# EAGLE design Controller Yanuar (EAGLE 7.7.0)
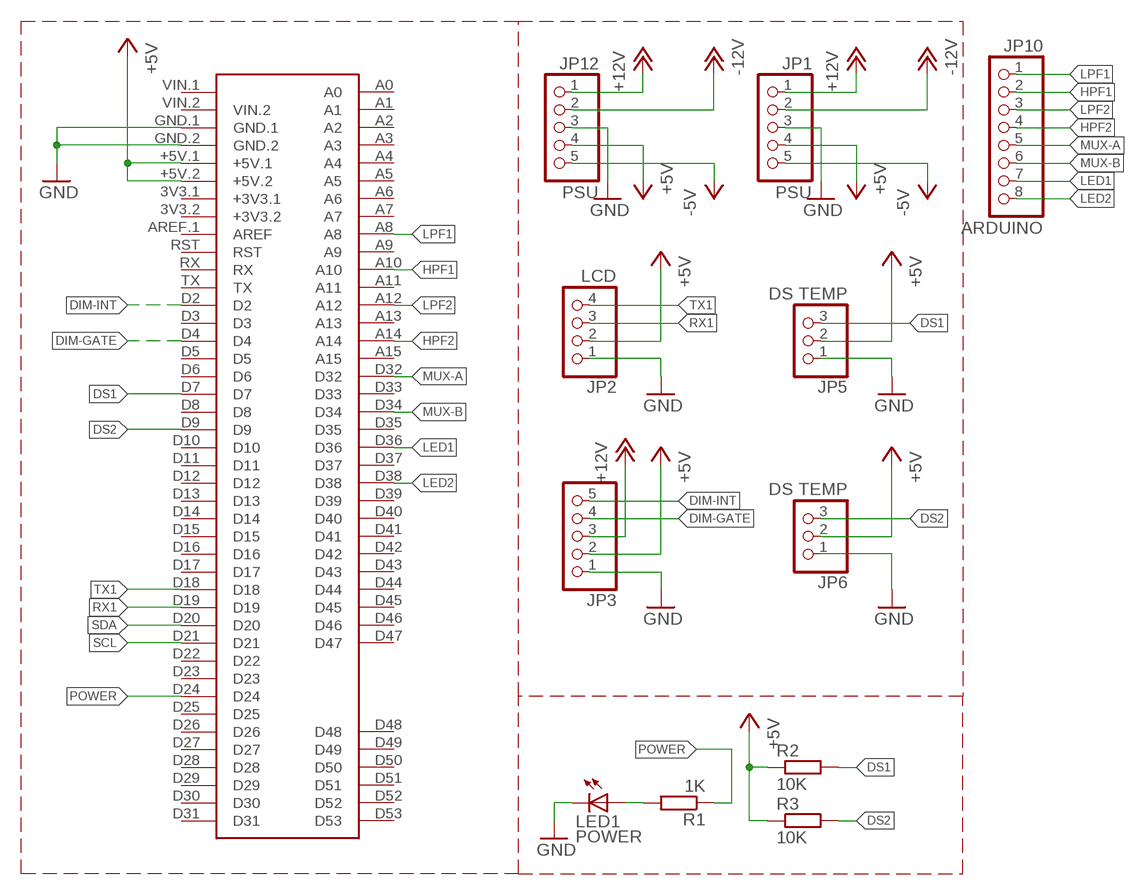
[diagram p0: schematic, sheet 1]

## Parts
JP1  PSU  PINHD-1X5"  [1X05]
JP2  LCD  PINHD-1X4  [1X04]
JP3  PINHD-1X5"  [1X05]
JP5  DS TEMP  PINHD-1X3  [1X03]
JP6  DS TEMP  PINHD-1X3  [1X03]
JP10  ARDUINO  PINHD-1X8  [1X08]
JP12  PSU  PINHD-1X5"  [1X05]
LED1  POWER  LEDLED3MM  [LED3MM]
R1  1K  R-EU_0207/7  [0207/7]
R2  10K  R-EU_0207/15  [0207/15]
R3  10K  R-EU_0207/15  [0207/15]
U$1  MEGA2560_MIKRO  [MEGA2560_MIKRO]

## Nets
+5V: JP1.4 JP2.2 JP3.2 JP5.2 JP6.2 JP12.4 R2.1 R3.1 U$1.+5V.1 U$1.+5V.2
+12V: JP1.1 JP3.3 JP12.1
-5V: JP1.5 JP12.5
-12V: JP1.2 JP12.2
DIM-GATE: JP3.4 U$1.D4
DIM-INT: JP3.5 U$1.D2
DS1: JP5.3 R2.2 U$1.D7
DS2: JP6.3 R3.2 U$1.D9
GND: JP1.3 JP2.1 JP3.1 JP5.1 JP6.1 JP12.3 LED1.K(C) U$1.GND.1 U$1.GND.2
HPF1: JP10.2 U$1.A10
HPF2: JP10.4 U$1.A14
LED1: JP10.7 U$1.D36
LED2: JP10.8 U$1.D38
LPF1: JP10.1 U$1.A8
LPF2: JP10.3 U$1.A12
MUX-A: JP10.5 U$1.D32
MUX-B: JP10.6 U$1.D34
N$2: LED1.A R1.2
POWER: R1.1 U$1.D24
RX1: JP2.3 U$1.D19
SCL: U$1.D21
SDA: U$1.D20
TX1: JP2.4 U$1.D18
Unconnected: U$1.3V3.1(+3V3.1) U$1.3V3.2(+3V3.2) U$1.A0 U$1.A1 U$1.A2 U$1.A3 U$1.A4 U$1.A5 U$1.A6 U$1.A7 U$1.A9 U$1.A11 U$1.A13 U$1.A15 U$1.AREF.1(AREF) U$1.D3 U$1.D5 U$1.D6 U$1.D8 U$1.D10 U$1.D11 U$1.D12 U$1.D13 U$1.D14 U$1.D15 U$1.D16 U$1.D17 U$1.D22 U$1.D23 U$1.D25 U$1.D26 U$1.D27 U$1.D28 U$1.D29 U$1.D30 U$1.D31 U$1.D33 U$1.D35 U$1.D37 U$1.D39 U$1.D40 U$1.D41 U$1.D42 U$1.D43 U$1.D44 U$1.D45 U$1.D46 U$1.D47 U$1.D48 U$1.D49 U$1.D50 U$1.D51 U$1.D52 U$1.D53 U$1.RST U$1.RX U$1.TX U$1.VIN.1 U$1.VIN.2

## Library data of the parts
JP1 JP3 JP12 = FansElectronics-Header:PINHD-1X5: PIN HEADER
JP2 = FansElectronics-Header:PINHD-1X4: PIN HEADER
JP5 JP6 = FansElectronics-Header:PINHD-1X3: PIN HEADER
JP10 = FansElectronics-Header:PINHD-1X8: PIN HEADER
LED1 = FansElectronics-LED:LED: LED : Tersedia berbagai ukuran dari DIL dan SMD
R1-R3 = FansElectronics-RCL:R-EU_: RESISTOR, European symbol
U$1 = MIKRO_MEGA2560:MEGA2560_MIKRO: Arduino Mega2560 pro robotDyn, create by mikroavr.com

## Board
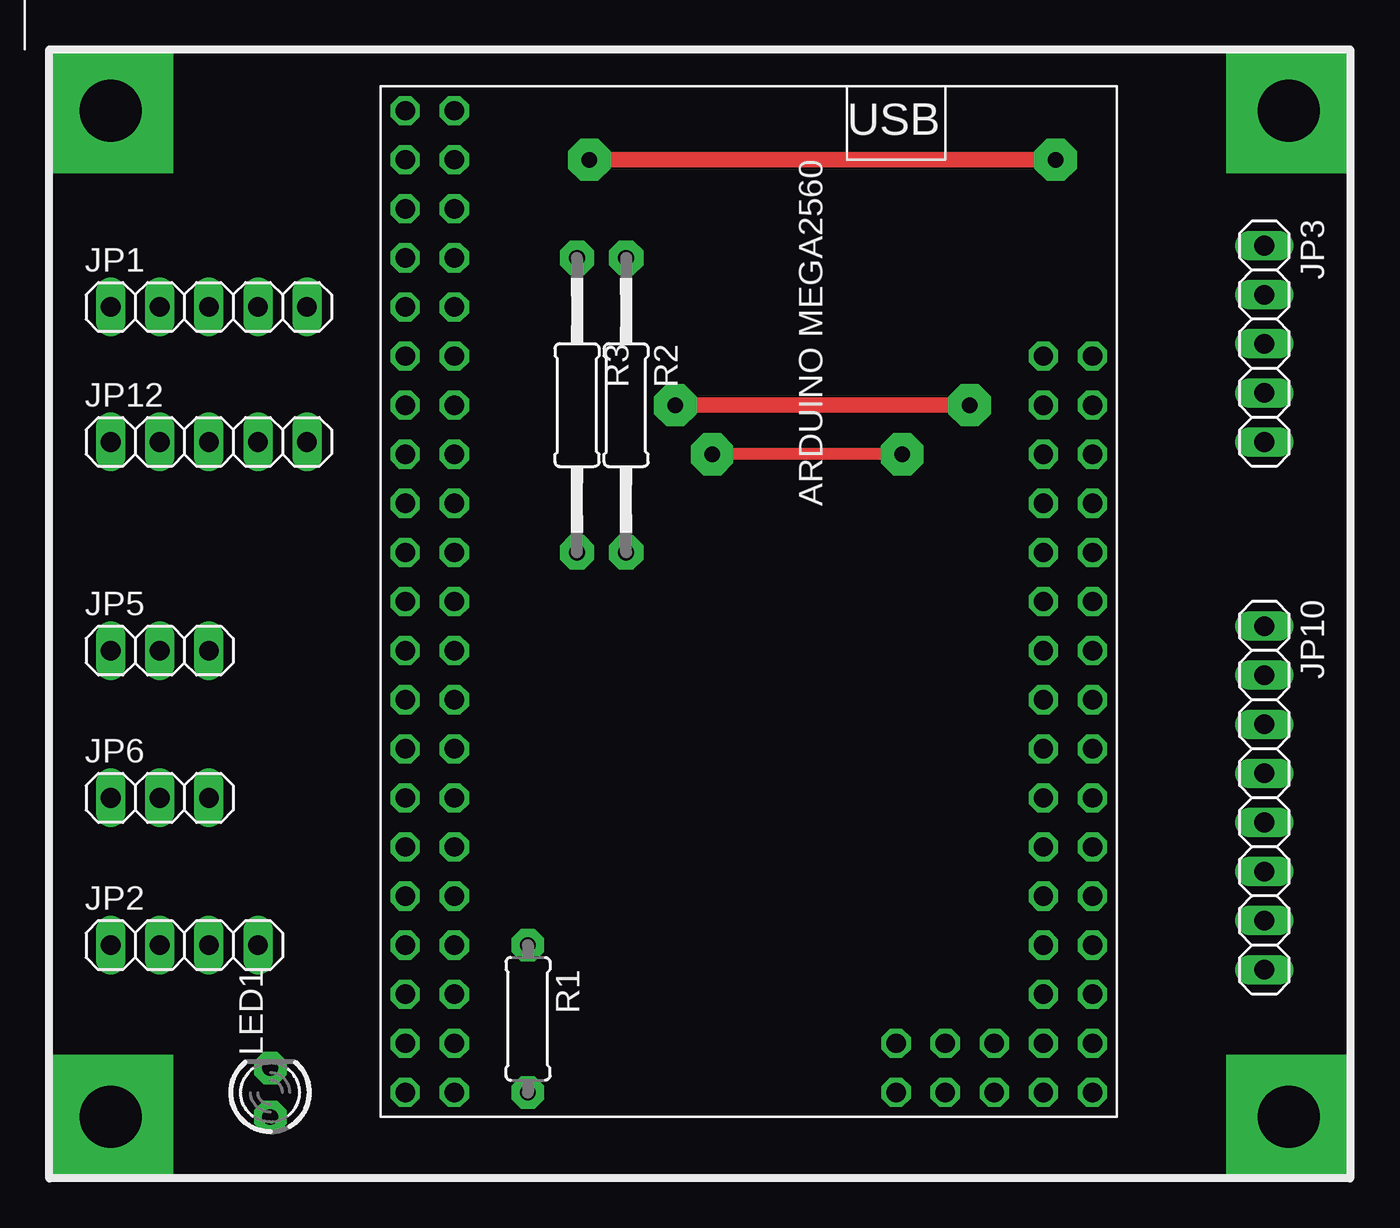
[diagram p1: board, top side]
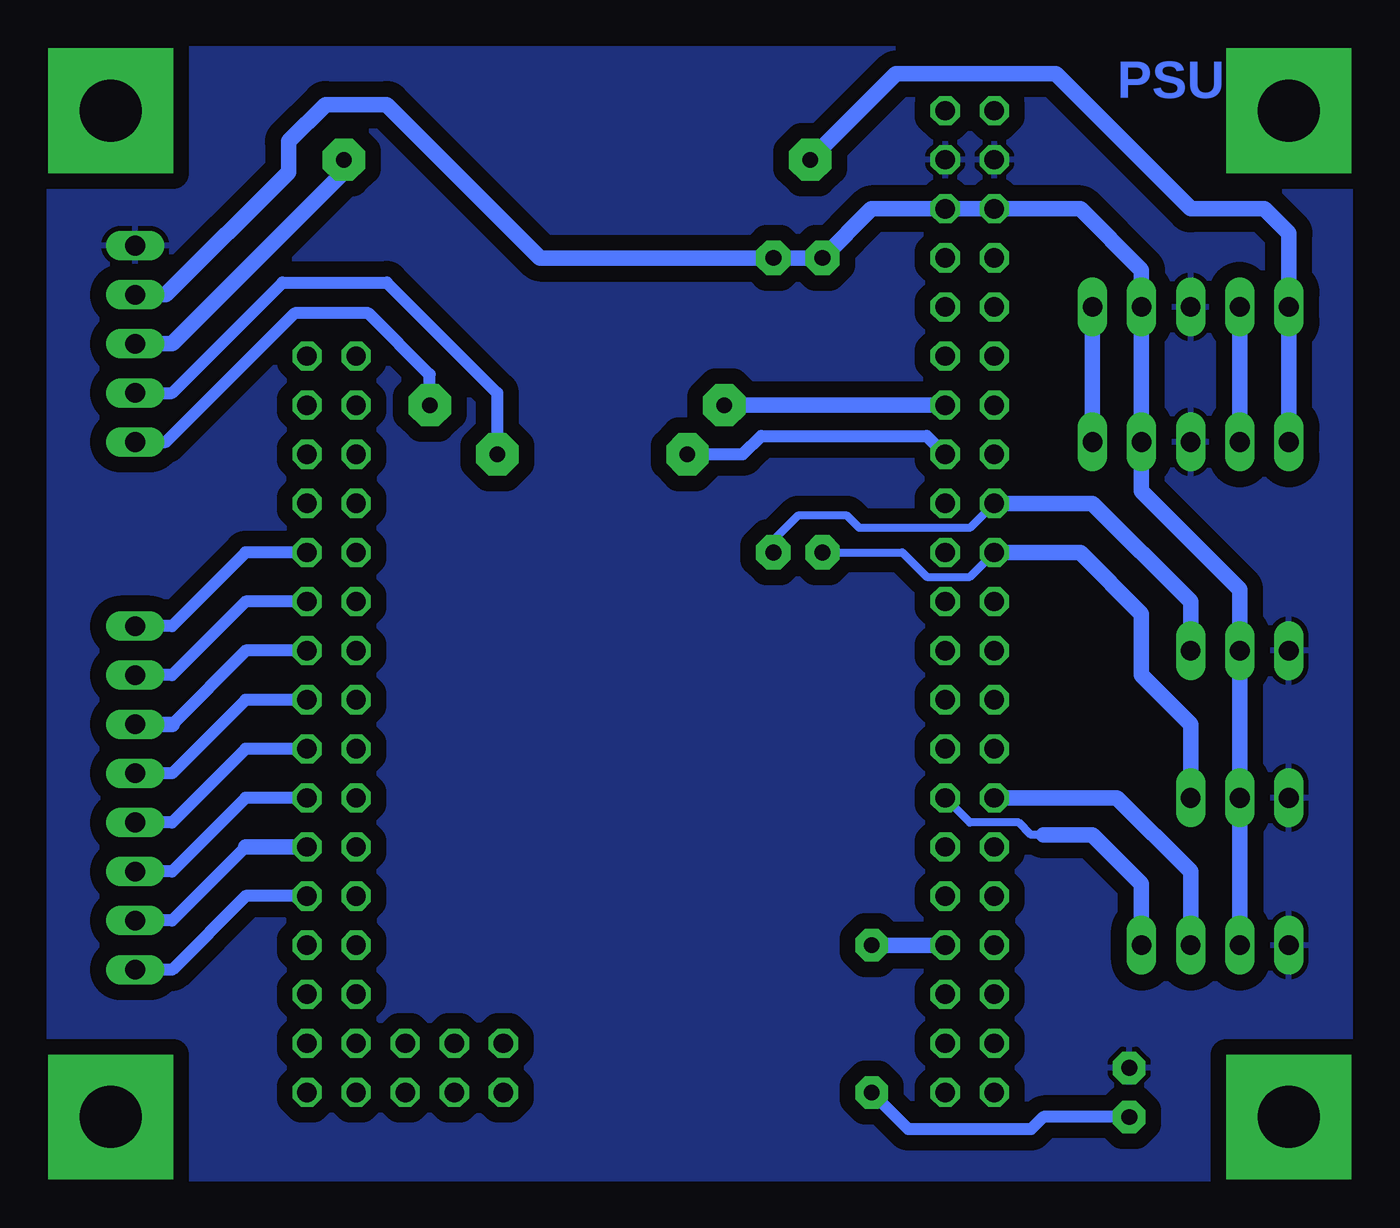
[diagram p2: board, bottom side, seen from below]

No outline drawn. Coordinates in mm, seen from the top.
Copper layers (1*16): Top 0.035mm / dielectric 1.5mm / Bottom 0.035mm
Design rules "default": minimum track width 10mil, minimum drill 24mil, track to track 8mil, track to pad 8mil, pad to pad 8mil, via to via 8mil, smd to smd 8mil, copper to edge 40mil, drill to drill 8mil, minimum pad ring 10mil, minimum via ring 8mil, stop-mask expansion 4mil, vias tented up to drill 0mil, thermal gap 10mil

### Footprints (pad centres in the part's own frame; a part is rotated, then mirrored left to right if it is on the bottom)
1X05 = drill 1.016 long: 1 -5.08,0; 2 -2.54,0; 3 0,0; 4 2.54,0; 5 5.08,0
1X04 = drill 1.016 long: 1 -3.81,0; 2 -1.27,0; 3 1.27,0; 4 3.81,0
1X03 = drill 1.016 long: 1 -2.54,0; 2 0,0; 3 2.54,0
1X08 = drill 1.016 long: 1 -8.89,0; 2 -6.35,0; 3 -3.81,0; 4 -1.27,0; 5 1.27,0; 6 3.81,0; 7 6.35,0; 8 8.89,0
LED3MM = drill 0.813 pad 1.676 octagon: A -1.27,0; K 1.27,0
0207/7 = drill 0.813 pad 1.676 octagon: 1 -3.81,0; 2 3.81,0
0207/15 = drill 0.813 pad 1.778 octagon: 1 -7.62,0; 2 7.62,0
MEGA2560_MIKRO = drill 1 octagon: 3V3.1 -26.67,-17.78; 3V3.2 -26.67,-20.32; +5V.1 -29.21,-17.78; +5V.2 -29.21,-20.32; A0 -21.59,15.24; A1 -21.59,12.7; A2 -19.05,15.24; A3 -19.05,12.7; A4 -16.51,15.24; A5 -16.51,12.7; A6 -13.97,15.24; A7 -13.97,12.7; A8 -11.43,15.24; A9 -11.43,12.7; A10 -8.89,15.24; A11 -8.89,12.7; A12 -6.35,15.24; A13 -6.35,12.7; A14 -3.81,15.24; A15 -3.81,12.7; AREF.1 -24.13,-17.78; D2 -19.05,-17.78; D3 -19.05,-20.32; D4 -16.51,-17.78; D5 -16.51,-20.32; D6 -13.97,-17.78; D7 -13.97,-20.32; D8 -11.43,-17.78; D9 -11.43,-20.32; D10 -8.89,-17.78; D11 -8.89,-20.32; D12 -6.35,-17.78; D13 -6.35,-20.32; D14 -3.81,-17.78; D15 -3.81,-20.32; D16 -1.27,-17.78; D17 -1.27,-20.32; D18 1.27,-17.78; D19 1.27,-20.32; D20 3.81,-17.78; D21 3.81,-20.32; D22 6.35,-17.78; D23 6.35,-20.32; D24 8.89,-17.78; D25 8.89,-20.32; D26 11.43,-17.78; D27 11.43,-20.32; D28 13.97,-17.78; D29 13.97,-20.32; D30 16.51,-17.78; D31 16.51,-20.32; D32 -1.27,15.24; D33 -1.27,12.7; D34 1.27,15.24; D35 1.27,12.7; D36 3.81,15.24; D37 3.81,12.7; D38 6.35,15.24; D39 6.35,12.7; D40 8.89,15.24; D41 8.89,12.7; D42 11.43,15.24; D43 11.43,12.7; D44 13.97,15.24; D45 13.97,12.7; D46 16.51,15.24; D47 16.51,12.7; D48 16.51,10.16; D49 13.97,10.16; D50 16.51,7.62; D51 13.97,7.62; D52 16.51,5.08; D53 13.97,5.08; GND.1 -31.75,-17.78; GND.2 -31.75,-20.32; RST -24.13,-20.32; RX -21.59,-17.78; TX -21.59,-20.32; VIN.1 -34.29,-17.78; VIN.2 -34.29,-20.32

### Placement (x,y rotation side)
JP1  19.05,74.93 0 top
JP2  17.78,41.91 0 top
JP3  73.66,73.03 270 top
JP5  16.51,57.15 0 top
JP6  16.51,49.53 0 top
JP10  73.66,49.53 270 top
JP12  19.05,67.94 0 top
LED1  22.23,34.29 90 top
R1  35.56,38.1 270 top
R2  40.64,69.85 270 top
R3  38.1,69.85 270 top
U$1  49.53,50.8 270 top

### Tracks (layer width: path | path; a pad name or v marks a point on that pad's centre or on a via)
+5V
  Bottom 0.813: JP2.2 JP6.2 JP5.2 16.51,60.33 21.59,65.41 JP12.4 JP1.4 21.59,76.83 24.77,80.01 U$1.+5V.2 U$1.+5V.1 35.56,80.01 R3.1 R2.1 52.7,77.47 60.64,85.41 63.82,85.41 65.72,83.5 65.72,81.92 72.07,75.56 JP3.2
+12V  (via drill 0.8 pad 2.18)
  Top 0.813: v38.73,82.55 v62.87,82.55
  Bottom 0.813: JP12.1 JP1.1 13.97,78.74 15.24,80.01 19.05,80.01 26.04,87 34.29,87 v38.73,82.55 | JP3.3 71.75,73.03 62.87,81.92 v62.87,82.55
-5V
  Bottom 0.813: JP1.5 JP12.5
-12V
  Bottom 0.813: JP12.2 JP1.2
DIM-GATE  (via drill 0.8 pad 2.18)
  Top 0.61: v54.93,67.31 v45.09,67.31
  Bottom 0.61: JP3.4 71.75,70.48 66.04,76.2 60.64,76.2 54.93,70.48 v54.93,67.31 | v45.09,67.31 42.23,67.31 41.27,68.26 32.7,68.26 U$1.D4
DIM-INT  (via drill 0.8 pad 2.18)
  Top 0.813: v43.18,69.85 v58.42,69.85
  Bottom 0.61: v58.42,69.85 58.42,71.44 61.59,74.61 65.41,74.61 72.07,67.94 JP3.5
  Bottom 0.813: U$1.D2 v43.18,69.85
DS1
  Bottom 0.406: U$1.D7 30.48,63.5 36.2,63.5 36.83,64.14 39.37,64.14 40.64,62.87 R2.2
  Bottom 0.813: JP5.3 19.05,59.69 24.13,64.77 U$1.D7
DS2
  Bottom 0.406: R3.2 33.97,62.23 32.7,60.96 30.48,60.96 U$1.D9
  Bottom 0.813: JP6.3 19.05,53.34 21.59,55.88 21.59,59.05 24.77,62.23 U$1.D9
GND
  pour Bottom (isolate 0.813): 10.79,88.27 78.11,88.27 78.11,29.84 10.79,29.84
HPF1
  Bottom 0.61: U$1.A10 67.94,59.69 71.75,55.88 JP10.2
HPF2
  Bottom 0.61: U$1.A14 67.94,54.61 71.75,50.8 JP10.4
LED1
  Bottom 0.61: 67.94,46.99 71.75,43.18 JP10.7
  Bottom 0.813: U$1.D36 67.94,46.99
LED2
  Bottom 0.61: U$1.D38 67.94,44.45 71.75,40.64 JP10.8
LPF1
  Bottom 0.61: U$1.A8 67.94,62.23 71.75,58.42 JP10.1
LPF2
  Bottom 0.61: U$1.A12 67.94,57.15 71.75,53.34
  Bottom 0.813: 71.75,53.34 JP10.3
MUX-A
  Bottom 0.61: U$1.D32 67.94,52.07 71.75,48.26 JP10.5
MUX-B
  Bottom 0.61: U$1.D34 67.94,49.53 71.75,45.72 JP10.6
N$1  (via drill 3.2 pad 6.45)
  other vias: 13.97,33.02
N$2
  Bottom 0.61: LED1.A 26.67,33.02 27.3,32.38 33.66,32.38 R1.2
N$3  (via drill 3.2 pad 6.45)
  other vias: 13.97,85.09
N$4  (via drill 3.2 pad 6.45)
  other vias: 74.93,85.09
N$5  (via drill 3.2 pad 6.45)
  other vias: 74.93,33.02
POWER
  Bottom 0.813: U$1.D24 R1.1
RX1
  Bottom 0.813: JP2.3 19.05,45.72 22.86,49.53 U$1.D19
TX1
  Bottom 0.406: 26.67,47.62 27.3,47.62 27.94,48.26 30.48,48.26 U$1.D18
  Bottom 0.813: JP2.4 21.59,45.09 24.13,47.62 26.67,47.62

### Text on the board
Bottom: PSU